# Altium schematic sheet Power.SchDoc
size A4; SheetNumber: 1; SheetTotal: 3
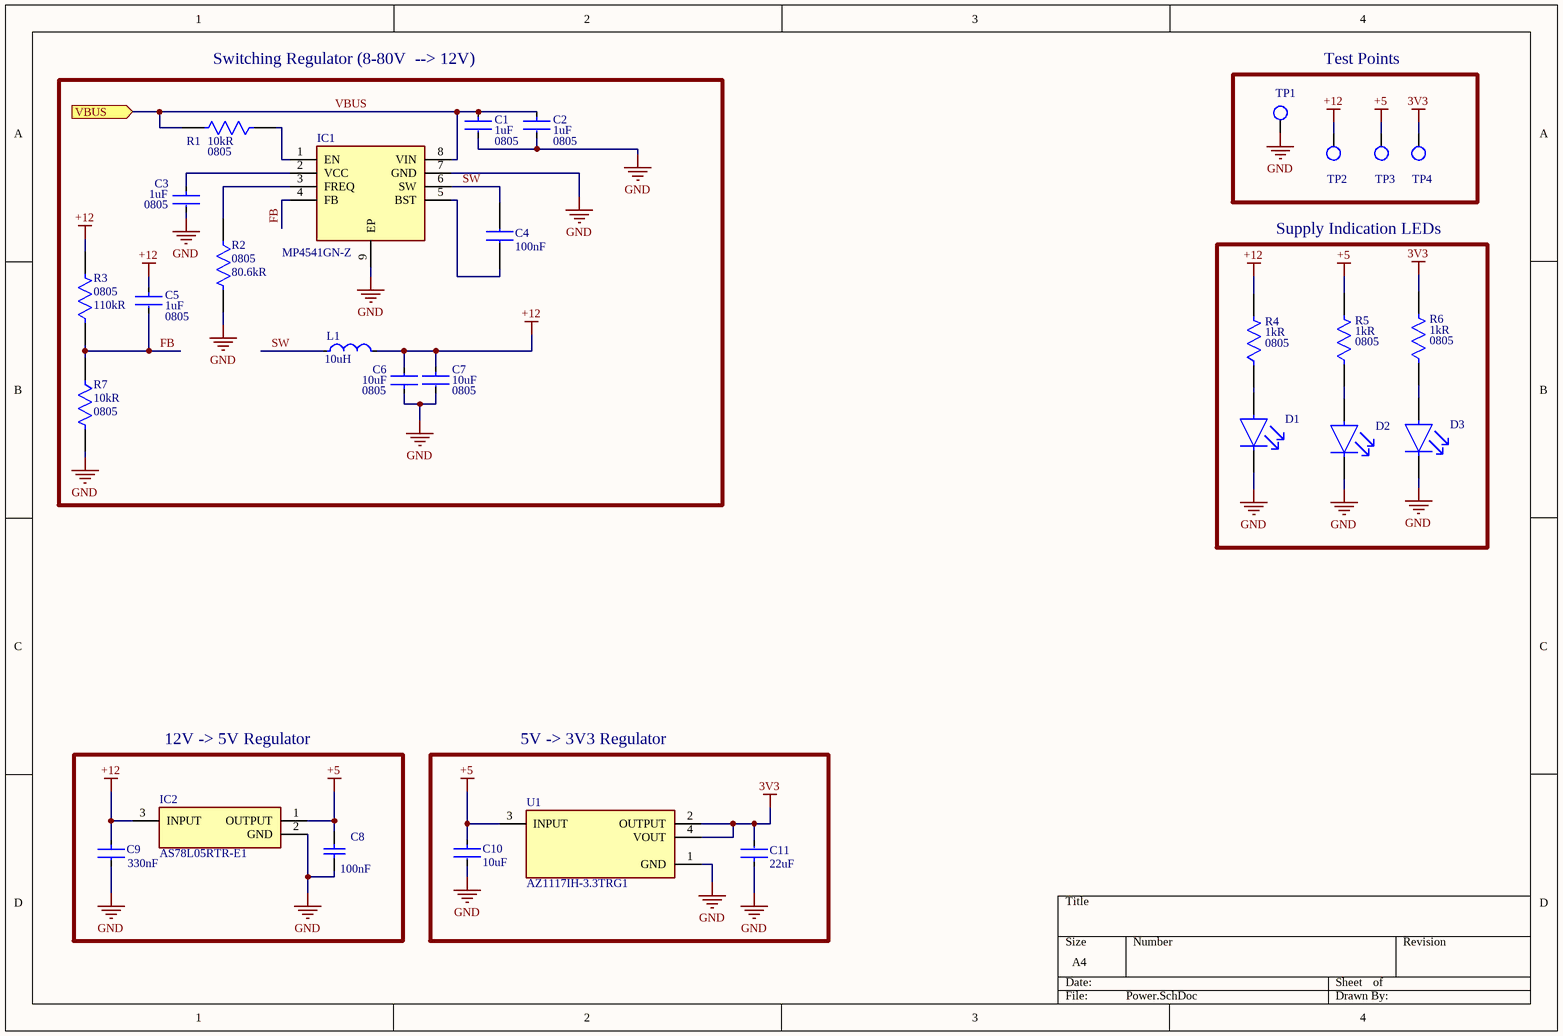
[diagram p0: Power.SchDoc]

## Parts
C1  Capacitance: 1uF  Case Code (Imperial): 0805  [FP-885012207078-MFG]  (hidden comment: 885012207078)
C2  Capacitance: 1uF  Case Code (Imperial): 0805  [FP-885012207078-MFG]  (hidden comment: 885012207078)
C3  Capacitance: 1uF  Case Code (Imperial): 0805  [FP-885012207078-MFG]  (hidden comment: 885012207078)
C4  Capacitance: 100nF  [C0805]  (hidden comment: C0805C104K1RACAUTO7210)
C5  Capacitance: 1uF  Case Code (Imperial): 0805  [FP-885012207078-MFG]  (hidden comment: 885012207078)
C6  Capacitance: 10uF  Case/Package: 0805  [FP-CL21-IPC_C]  (hidden comment: CL21A106KOQNNNG)
C7  Capacitance: 10uF  Case/Package: 0805  [FP-CL21-IPC_C]  (hidden comment: CL21A106KOQNNNG)
C8  Capacitance: 100nF  [CAPC2013X140X50ML20T25]  (hidden comment: 08055D104KAT2A)
C9  Capacitance: 330nF  [FP-CL21-F-IPC_C]  (hidden comment: CL21B334KBFNNNE)
C10  Capacitance: 10uF  [FP-CL21-IPC_B]  (hidden comment: CL21A106KOQNNNE)
C11  Capacitance: 22uF  [FP-CL21-IPC_B]  (hidden comment: CL21A226MQQNNNG)
D1  12V  [FP-150060VS75000-MFG]  (value not drawn)
D2  5V  [FP-150060VS75000-MFG]  (value not drawn)
D3  3V3  [FP-150060VS75000-MFG]  (value not drawn)
IC1  MP4541GN-Z  [SOIC127P600X170-9N]
IC2  AS78L05RTR-E1  [DIODES_SOT-89]
L1  Inductance: 10uH  [FP-LB2518-1_8-0_2-IPC_A]  (hidden comment: LBR2518T100K)
R1  Resistance: 10kR  Case Code (Imperial): 0805  [FP-RMCF0805-IPC_A]  (hidden comment: RMCF0805JT10K0)
R2  Case/Package: 0805  Resistance: 80.6kR  [FP-CRCW0805-e3-IPC_A]  (hidden comment: CRCW080580K6FKEA)
R3  Size Code: 0805  Resistance: 110kR  [FP-RMCF0805-IPC_C]  (hidden comment: RMCF0805FT110K)
R4  Resistance: 1kR  Size Code: 0805  [FP-RNCP0805-MFG]  (hidden comment: RNCP0805FTD1K00)
R5  Resistance: 1kR  Size Code: 0805  [FP-RNCP0805-MFG]  (hidden comment: RNCP0805FTD1K00)
R6  Resistance: 1kR  Size Code: 0805  [FP-RNCP0805-MFG]  (hidden comment: RNCP0805FTD1K00)
R7  Resistance: 10kR  Case Code (Imperial): 0805  [FP-RMCF0805-IPC_A]  (hidden comment: RMCF0805JT10K0)
TP1  GND  [TESTPOINT_LOOP]  (value not drawn)
TP2  12V  [TESTPOINT_LOOP]  (value not drawn)
TP3  5V  [TESTPOINT_LOOP]  (value not drawn)
TP4  3V3  [TESTPOINT_LOOP]  (value not drawn)
U1  AZ1117IH-3.3TRG1  [FP-SOT223-IPC_B]

## Blocks framed on the sheet
Switching Regulator (8-80V  --> 12V): C1-C7 IC1 L1 R1-R3 R7
Test Points: TP1-TP4
Supply Indication LEDs: D1-D3 R4-R6
12V -> 5V Regulator: C8 C9 IC2
5V -> 3V3 Regulator: C10 C11 U1

## Ports
VBUS (in)

## Nets
3V3: C11.2 R6.2 TP4.1 U1.2(OUTPUT) U1.4(VOUT)
+5: C8.2 C10.1 IC2.1(OUTPUT) R5.2 TP3.1 U1.3(INPUT)
+12: C5.1 C6.2 C7.1 C9.1 IC2.3(INPUT) L1.2 R3.2 R4.2 TP2.1
GND: C1.2 C2.2 C3.2 C6.1 C7.2 C8.1 C9.2 C10.2 C11.1 D1.1(C) D2.1(C) D3.1(C) IC1.7(GND) IC1.9(EP) IC2.2(GND) R2.2 R7.2 TP1.1 U1.1(GND)
FB: C5.2 IC1.4(FB) R3.1 R7.1
SW: C4.2 IC1.6(SW) L1.1
VBUS: C1.1 C2.1 IC1.8(VIN) R1.2 ; port VBUS
NetC3_1: C3.1 IC1.2(VCC)
NetC4_1: C4.1 IC1.5(BST)
NetD1_2: D1.2(A) R4.1
NetD2_2: D2.2(A) R5.1
NetD3_2: D3.2(A) R6.1
NetIC1_1: IC1.1(EN) R1.1
NetIC1_3: IC1.3(FREQ) R2.1

## Library data of the parts
C1-C3 C5 = CMP-207839-000010-1: CAP CER 1UF 25V X7R 0805; Tolerance: 10%; Series: WCAP-CSGP; Mount: Surface Mount; RoHS Compliant: Yes; Case Code (Metric): 2012; Width: 0.049inch; Thickness: 0.053inch; Dielectric: X7R; Max Operating Temperature: 125°C; Case/Package: 0805; Length: 0.079inch; Voltage Rating: 25V; Packaging: Cut Tape; Min Operating Temperature: -55°C; Voltage Rating (DC): 25V
C4 = C0805C104K1RACAUTO7210: Capacitor; Manufacturer_Name: KEMET; Datasheet Link: https://content.kemet.com/datasheets/KEM_C1023_X7R_AUTO_SMD.pdf; Height: 1.1mm; Manufacturer_Part_Number: C0805C104K1RACAUTO7210; Mouser Part Number: 80-C0805C104K1RAUTLR; Mouser Price/Stock: https://www.mouser.co.uk/ProductDetail/KEMET/C0805C104K1RACAUTO7210?qs=NJR6qtu0rR34GE7CYHVK6Q%3D%3D; Arrow Part Number: C0805C104K1RACAUTO7210; Arrow Price/Stock: https://www.arrow.com/en/products/c0805c104k1racauto7210/kemet-corporation?region=europe
C6 C7 = CMP-13271-002240-1: CL21 Series 0805 10uF 16V ±10% Tolerance X5R Multilayer Ceramic Chip Capacitor; Case Code (Metric): 2012; Package Quantity: 3000; Width: 0.049inch; Mount: Surface Mount; Depth: 1.25mm; Material: Ceramic; Min Operating Temperature: -55°C; Thickness: 0.053inch; Tolerance: 10%; Case Code (Imperial): 0805; Packaging: Tape and Reel; Voltage Rating: 16V; Height: 1.25mm; Voltage: 16V; Max Operating Temperature: 85°C; Length: 2mm; Dielectric: X5R
C8 = CMP-2007-04689-1: Manufacturer: AVX Interconnect / Elco; Part Number: 08055D104KAT2A
C9 = CMP-13271-000003-1: CAP CER 0.33UF 50V X7R 0805; Manufacturer: Samsung Electro-Mechanics; Temperature Coefficient: 15%; Value: 330nF; Material: Ceramic; Tolerance: 10%; Category: Cap; Temperature Range Low: -55°C; Height: 1.35mm; Ipc Land Pattern Name: CAPC200125X125; ComponentLink2URL: http://www.samsungsem.com/kr/support/product-search/mlcc/__icsFiles/afieldfile/2018/07/24/CL21B334KBFNNNE.pdf; Octopart: https://octopart.com/cl21b334kbfnnne-samsung-9287149; Digikey Description: CAP CER 0.33UF 50V X7R 0805; Automotive: No; ComponentLink2Description: Datasheet; Lead Free: Yes; Voltage Rating: 50V; Device Class L2: Capacitors; Device Class L1: Passive Components; RoHS: TRUE; Manufacturer Part Number: CL21B334KBFNNNE; Temperature: -55°C to +125°C; Package: CL21-F; Temperature Range High: +125°C; Temperature Characteristic: X7R; Device Class L3: Ceramic Capacitors
C10 = CMP-2000-06102-2: CL21 Series 0805 10uF 16V ±10% Tolerance X5R Multilayer Ceramic Chip Capacitor; Dielectric: X7R; Length: 2mm; Depth: 1.25mm; Voltage: 16V; Width: 0.049inch; Lead Free: Lead Free; Max Operating Temperature: 85°C; Mount: Surface Mount; Voltage Rating: 16V; Height: 1.25mm; Radiation Hardening: No; Packaging: Tape and Reel; Voltage Rating (DC): 16V; Thickness: 0.055inch; Case/Package: 0805; Case Code (Imperial): 0805; Min Operating Temperature: -55°C; Case Code (Metric): 2012; Package Quantity: 1; Tolerance: 10%
C11 = CMP-13271-002967-1: CL21 Series 0805 22uF 6.3V ±20% Tolerance X5R Multilayer Ceramic Chip Capacitor; Tolerance: 20%; Case Code (Imperial): 0805; Package Quantity: 3000; Min Operating Temperature: -55°C; Case Code (Metric): 2012; Length: 2mm; Material: Ceramic; Max Operating Temperature: 85°C; Radiation Hardening: No; Packaging: Tape and Reel; Depth: 1.25mm; Mount: Surface Mount; Dielectric: X5R; Case/Package: 0805; Height: 1.25mm; Thickness: 0.055inch; Voltage: 6.3V; Width: 0.049inch; Voltage Rating: 6.3V
D1 D3 = CMP-1426-00006-5: LED GREEN CLEAR 0603 SMD; Viewing Angle: 140°; Reverse Voltage (DC): 5V; Forward Voltage: 2V; Power Rating: 72mW; Lens Size: 0.7mm; Test Current: 20mA; Lens Color: Colorless; Lens Style: Rectangular; Luminous Intensity: 40mcd; Wavelength: 570nm; Length: 1.6mm; Max Operating Temperature: 85°C; Lens Transparency: Clear; Width: 0.8mm; Mount: Surface Mount; Weight: 0.000882oz; Package Quantity: 4000; Packaging: Cut Tape; RoHS Compliant: Yes; Case/Package: 0603; Series: WL-SMCW; Case Code (Metric): 1608; Illumination Color: Green; Color: Green; Case Code (Imperial): 0603; Forward Current: 20mA; Min Operating Temperature: -40°C; Height: 0.8mm; Dominant Wavelength: 570nm; Number of Pins: 2
D2 = CMP-1426-00006-5: LED GREEN CLEAR 0603 SMD; Viewing Angle: 140°; Forward Voltage: 2V; Power Rating: 72mW; Lens Size: 0.7mm; Test Current: 20mA; Lens Color: Colorless; Lens Style: Rectangular; Luminous Intensity: 40mcd; Wavelength: 570nm; Length: 1.6mm; Max Operating Temperature: 85°C; Reverse Voltage (DC): 5V; Lens Transparency: Clear; Width: 0.8mm; Mount: Surface Mount; Weight: 0.000882oz; Package Quantity: 4000; Packaging: Cut Tape; RoHS Compliant: Yes; Case/Package: 0603; Series: WL-SMCW; Case Code (Metric): 1608; Illumination Color: Green; Color: Green; Case Code (Imperial): 0603; Forward Current: 20mA; Min Operating Temperature: -40°C; Height: 0.8mm; Dominant Wavelength: 570nm; Number of Pins: 2
IC1 = MP4541GN-Z: Integrated Circuit; Manufacturer_Name: Monolithic Power Systems (MPS); Datasheet Link: https://www.monolithicpower.com/en/documentview/productdocument/index/version/2/document_type/Datasheet/lang/en/sku/MP4541GN/; Height: 1.7mm; Manufacturer_Part_Number: MP4541GN-Z; Mouser Part Number: 946-MP4541GN-Z; Mouser Price/Stock: https://www.mouser.co.uk/ProductDetail/Monolithic-Power-Systems-MPS/MP4541GN-Z?qs=TCDPyi3sCW3JrMFxnpK4AA%3D%3D
IC2 = AS78L05RTR-E1: Integrated Circuit; Manufacturer_Name: Diodes Inc.; Datasheet Link: https://www.diodes.com/assets/Datasheets/AS78Lxx.pdf; Manufacturer_Part_Number: AS78L05RTR-E1; Mouser Part Number: 621-AS78L05RTR-E1; Mouser Price/Stock: https://www.mouser.co.uk/ProductDetail/Diodes-Incorporated/AS78L05RTR-E1?qs=FKu9oBikfSksfBIasZ7FtQ%3D%3D; Arrow Part Number: AS78L05RTR-E1; Arrow Price/Stock: https://www.arrow.com/en/products/as78l05rtr-e1/diodes-incorporated?region=asia
L1 = CMP-14484-000483-1: SMD Inductors 10uH ±10% 0.235A 0.247Ω 1007; Test Frequency: 2.52MHz; Core Material: Ferrite; Max DC Current: 235mA; Shielding: Unshielded; DC Resistance (DCR): 190mR; Self Resonant Frequency: 30MHz; Package Quantity: 2000; Height - Seated (Max): 0.079inch; Lead Free: Lead Free; Radiation Hardening: No; Case Code (Metric): 2518; Mount: Surface Mount; Current Rating: 235mA; Width: 0.071inch; Military Standard: Not; Tolerance: 10%; Series: LB; Case/Package: 1007; Termination: SMD/SMT; DC Current: 235mA; Height: 1.8mm; Inductance Tolerance: 10%; Max Operating Temperature: 105°C; Packaging: Tape and Reel; Case Code (Imperial): 1007; Min Operating Temperature: -40°C; Depth: 2mm; Resistor Type: Wirewound; RoHS Compliant: Yes; Halogen Free: Halogen Free; Length: 0.098inch; Lead Pitch: 1.5mm
R1 R7 = CMP-26527-002663-1: 10kΩ ±5% 0.125W 0805 Thick Film Chip Resistor AEC-Q200 compliant; Max Power Dissipation: 125mW; Temperature Coefficient: 100ppm/°C; Construction: Rectangular; RoHS Compliant: Yes; Resistor Type: Thick Film; Series: RMCF; Features: Automotive AEC-Q200; Mount: Surface Mount; Min Operating Temperature: -55°C; Military Standard: Not; Tolerance: 5%; Size Code: 0805; Contact Plating: Tin; Length: 2mm; Depth: 1.25mm; Case Code (Metric): 2012; Packaging: Tape and Reel; Radiation Hardening: No; Height: 0.026inch; Case/Package: 0805; Width: 0.049inch; Lead Free: Lead Free; Max Operating Temperature: 155°C; Number of Terminations: 2; Power Rating: 125mW
R2 = CMP-2001-04127-2: RES Thick Film, 80.6kΩ, 1%, 0.125W, 100ppm/°C, 0805; Power Rating: 125mW; Voltage Rating: 150V; Tolerance: 1%; Min Operating Temperature: -55°C; Number of Pins: 2; Max Power Dissipation: 125mW; Radiation Hardening: No; Max Operating Temperature: 155°C; Composition: Thick Film; Temperature Coefficient: 100ppm/°C; Width: 1.25mm; Length: 2mm; Case Code (Metric): 2012; Packaging: Tape and Reel; Contact Plating: Tin; Termination: Solder; Features: Automotive AEC-Q200; Number of Terminations: 2; Military Standard: Not; Weight: 0.000194oz; Case Code (Imperial): 0805; Depth: 1.25mm; Lead Free: Lead Free; Package Quantity: 10; Height: 0.45mm; Voltage Rating (DC): 150V
R3 = CMP-26527-000712-1: 110kΩ ±1% 0.125W 0805 Thick Film Chip Resistor AEC-Q200 compliant; Power Rating: 125mW; Temperature Coefficient: 100ppm/°C; Features: Automotive AEC-Q200; Radiation Hardening: No; Width: 0.049inch; RoHS Compliant: Yes; Length: 0.079inch; Max Power Dissipation: 125mW; Case Code (Imperial): 0805; Mount: Surface Mount; Series: RMCF; Max Operating Temperature: 155°C; Lead Free: Lead Free; Case Code (Metric): 2012; Height: 0.026inch; Case/Package: 0805; Number of Terminations: 2; Resistor Type: Thick Film; Packaging: Tape and Reel; Tolerance: 1%; Contact Plating: Tin; Min Operating Temperature: -55°C
R4-R6 = CMP-26527-001902-1: 1kΩ ±1% 0.25W 0805 High Power Anti-Sulfur Thin Film Chip Resistor; Power Rating: 250mW; Temperature Coefficient: 100ppm/°C; Series: RNCP; RoHS Compliant: Yes; Case Code (Metric): 2012; Length: 0.079inch; Case/Package: 0805; Max Power Dissipation: 250mW; Height: 0.024inch; Max Operating Temperature: 155°C; Tolerance: 1%; Min Operating Temperature: -55°C; Width: 0.049inch; Case Code (Imperial): 0805; Packaging: Tape and Reel; Mount: Surface Mount; Features: Moisture Resistant; Lead Free: Lead Free; Resistor Type: Thin Film; Number of Terminations: 2
TP1-TP4 = TESTPOINT_LOOP: PC TEST POINT MINIATURE WHITE; Manufacturer 1: Keystone Electronics; Manufacturer Part Number 1: 5002; Supplier Part Number 1: 36-5002-ND; Supplier 1: Digi-Key; Mount: Through Hole
U1 = CMP-12756-000043-1: IC REG LINEAR 3.3V 1A SOT223; Output Current: 800mA; Number of Regulators: 1; Dropout Voltage: 1.2V; RoHS Compliant: Yes; Min Current Limit: 1A; Mount: Surface Mount; Packaging: Tape and Reel; Output Voltage: 3.3V; Min Operating Temperature: -40°C; Max Operating Temperature: 125°C; Number of Pins: 3; Case/Package: TO-261-4